# EAGLE design KeezerStat (EAGLE 5.09)
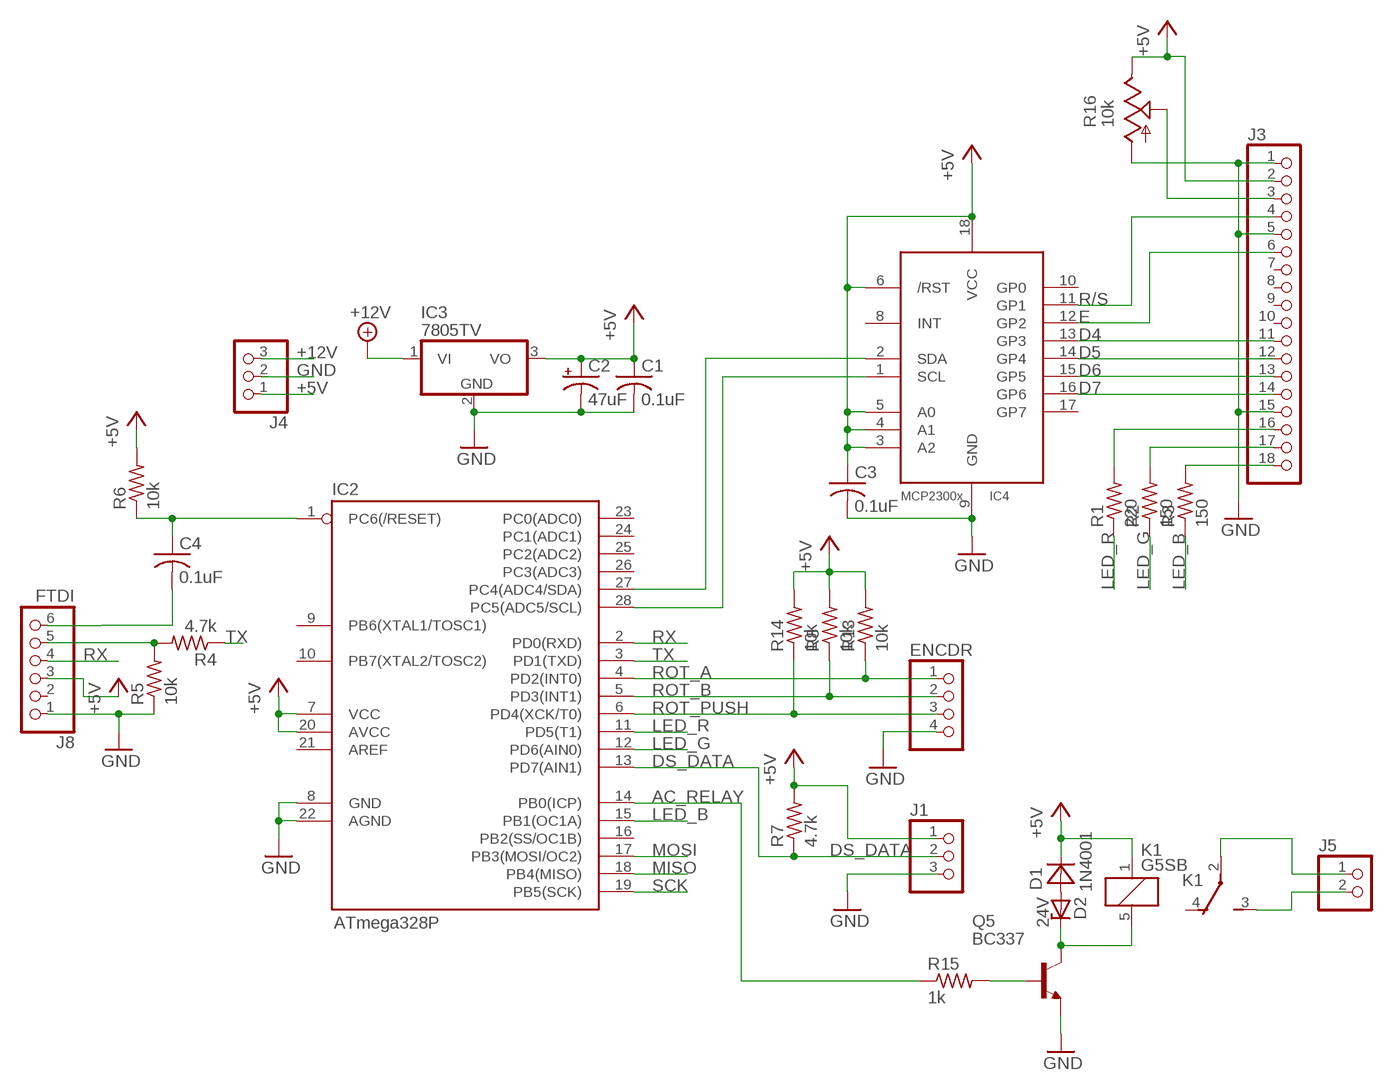
[diagram p0: schematic, sheet 1]

## Parts
C1  0.1uF  C-US025-025X050  [C025-025X050]
C2  47uF  CPOL-USE2.5-6  [E2,5-6]
C3  0.1uF  C-US025-025X050  [C025-025X050]
C4  0.1uF  C-US025-025X050  [C025-025X050]
D1  1N4001  DIODE-DO41-7  [DO41-7]
D2  24V  ZENER-DIODEZD-7.5  [ZDIO-7.5]
ENCDR  PINHD-1X4  [1X04]
IC2  ATmega328P  AVR-MEGA8-PPTH  [DIL28-3]
IC3  7805TV  [TO220V]
IC4  MCP2300X/P  [DIL18]
J1  PINHD-1X3  [1X03]
J3  PINHD-1X18  [1X18]
J4  PINHD-1X3  [1X03]
J5  PINHD-1X2  [1X02]
J8  FTDI  PINHD-1X6  [1X06]
K1  G5SB  [G5SB]
Q5  BC337  [TO92]
R1  220  R-US_0204/7  [0204/7]
R2  150  R-US_0204/7  [0204/7]
R3  150  R-US_0204/7  [0204/7]
R4  4.7k  R-US_0204/7  [0204/7]
R5  10k  R-US_0204/7  [0204/7]
R6  10k  R-US_0204/7  [0204/7]
R7  4.7k  R-US_0204/7  [0204/7]
R8  10k  R-US_0204/7  [0204/7]
R13  10k  R-US_0204/7  [0204/7]
R14  10k  R-US_0204/7  [0204/7]
R15  1k  R-US_0204/7  [0204/7]
R16  10k  TRIM_US-CT6  [CT6]

## Nets
+5V: C1.1 C2.+ C3.1 D1.C IC2.7(VCC) IC2.20(AVCC) IC3.3(VO) IC4.3(A2) IC4.4(A1) IC4.5(A0) IC4.6(/RST) IC4.18(VCC) J1.1 J3.2 J4.1 J8.3 K1.1 R6.2 R7.2 R8.2 R13.2 R14.2 R16.E
+12V: IC3.1(VI) J4.3
AC_RELAY: IC2.14(PB0(ICP)) R15.1
D4: IC4.13(GP3) J3.11
D5: IC4.14(GP4) J3.12
D6: IC4.15(GP5) J3.13
D7: IC4.16(GP6) J3.14
DS_DATA: IC2.13(PD7(AIN1)) J1.2 R7.1
E: IC4.12(GP2) J3.6
GND: C1.2 C2.- C3.2 ENCDR.4 IC2.8(GND) IC2.22(AGND) IC3.2(GND) IC4.9(GND) J1.3 J3.1 J3.5 J3.15 J4.2 J8.1 Q5.1(E) R5.1 R16.A
HOTIN: J5.1 K1.2(U:P)
HOTOUT: J5.2 K1.3(U:S)
LED_B: IC2.15(PB1(OC1A)) R3.1
LED_G: IC2.12(PD6(AIN0)) R2.1
LED_R: IC2.11(PD5(T1)) R1.1
MISO: IC2.18(PB4(MISO))
MOSI: IC2.17(PB3(MOSI/OC2))
N$1: J3.18 R3.2
N$2: J3.17 R2.2
N$3: J3.16 R1.2
N$4: J8.5 R4.2 R5.2
N$5: D1.A D2.A
N$6: J3.3 R16.S
N$7: IC2.27(PC4(ADC4/SDA)) IC4.2(SDA)
N$8: IC2.28(PC5(ADC5/SCL)) IC4.1(SCL)
N$9: C4.2 J8.6
N$10: C4.1 IC2.1(PC6(/RESET)) R6.1
N$17: Q5.2(B) R15.2
N$19: D2.C K1.5 Q5.3(C)
R/S: IC4.11(GP1) J3.4
ROT_A: ENCDR.1 IC2.4(PD2(INT0)) R13.1
ROT_B: ENCDR.2 IC2.5(PD3(INT1)) R8.1
ROT_PUSH: ENCDR.3 IC2.6(PD4(XCK/T0)) R14.1
RX: IC2.2(PD0(RXD)) J8.4
SCK: IC2.19(PB5(SCK))
TX: IC2.3(PD1(TXD)) R4.1
Unconnected: IC2.9(PB6(XTAL1/TOSC1)) IC2.10(PB7(XTAL2/TOSC2)) IC2.16(PB2(SS/OC1B)) IC2.21(AREF) IC2.23(PC0(ADC0)) IC2.24(PC1(ADC1)) IC2.25(PC2(ADC2)) IC2.26(PC3(ADC3)) IC4.8(INT) IC4.10(GP0) IC4.17(GP7) J3.7 J3.8 J3.9 J3.10 J8.2 K1.4(U:O)

## Library data of the parts
C1 C3 C4 = resistor:C-US: CAPACITOR, American symbol
C2 = resistor:CPOL-US: POLARIZED CAPACITOR, American symbol
D1 = Bryan:DIODE-: DO41 diodes with octagon holes and no diode symbol in silk
D2 = diode:ZENER-DIODE: Z-Diode
ENCDR = pinhead:PINHD-1X4: PIN HEADER
IC2 = SparkFun:AVR-MEGA8-P: MICROCONTROLLER 8 Kbytes FLASH 1 kbytes SRAM 512 bytes EEPROM USART 4-channel 10 bit ADC 2-channel 8 bit ADC
IC3 = linear:78*: Positive VOLTAGE REGULATOR Source: http://cache.national.com/ds/LM/LM78L05.pdf http://www.fairchildsemi.com/ds/LM/LM7805.pdf
IC4 = adafruit:MCP2300X: MCP23008 Inexpensive i2c i/o expander - 8 general purpose i/o pins with optional pullups
J1 J4 = pinhead:PINHD-1X3: PIN HEADER
J3 = pinhead:PINHD-1X18: PIN HEADER
J5 = pinhead:PINHD-1X2: PIN HEADER
J8 = pinhead:PINHD-1X6: PIN HEADER
K1 = relay:G5SB: Compact Single-pole Relay for Switching 5 A Source: http://www.omron.com/ecb/products/pry/121/g5sb.html
Q5 = transistor-npn:BC337*: NPN Transistor
R1-R8 R13-R15 = resistor:R-US_: RESISTOR, American symbol
R16 = pot:TRIM_US-: POTENTIOMETER

## Net classes
1 POW: width 0.381 mm
2 HIGHPOW: width 0.508 mm

## Board
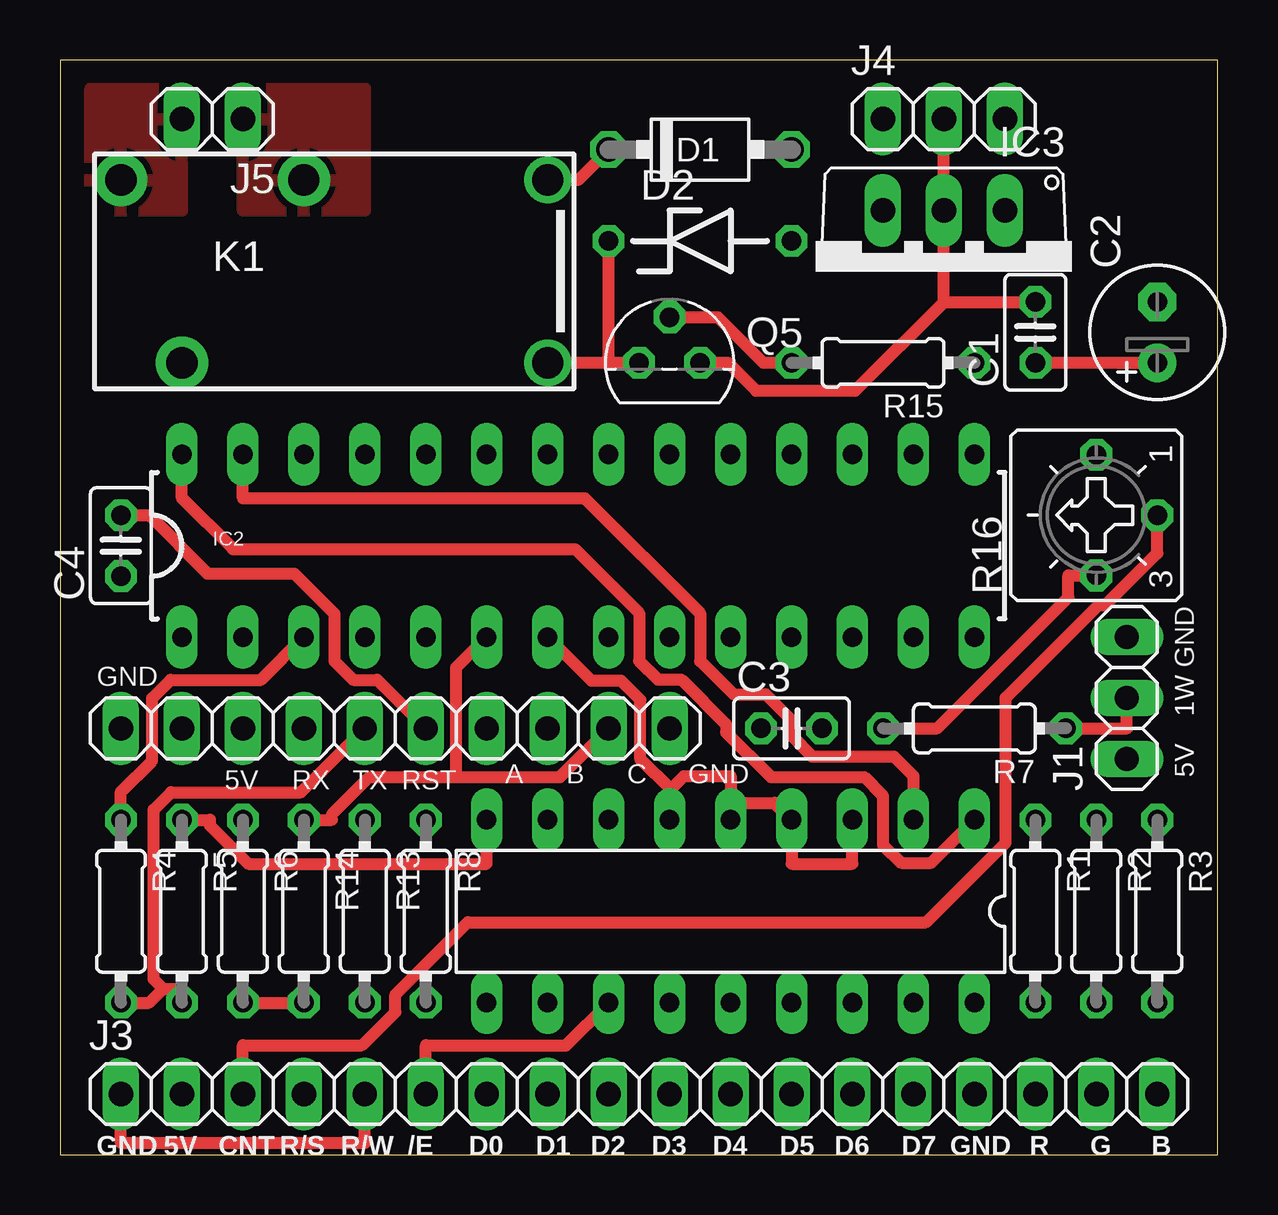
[diagram p1: board, top side]
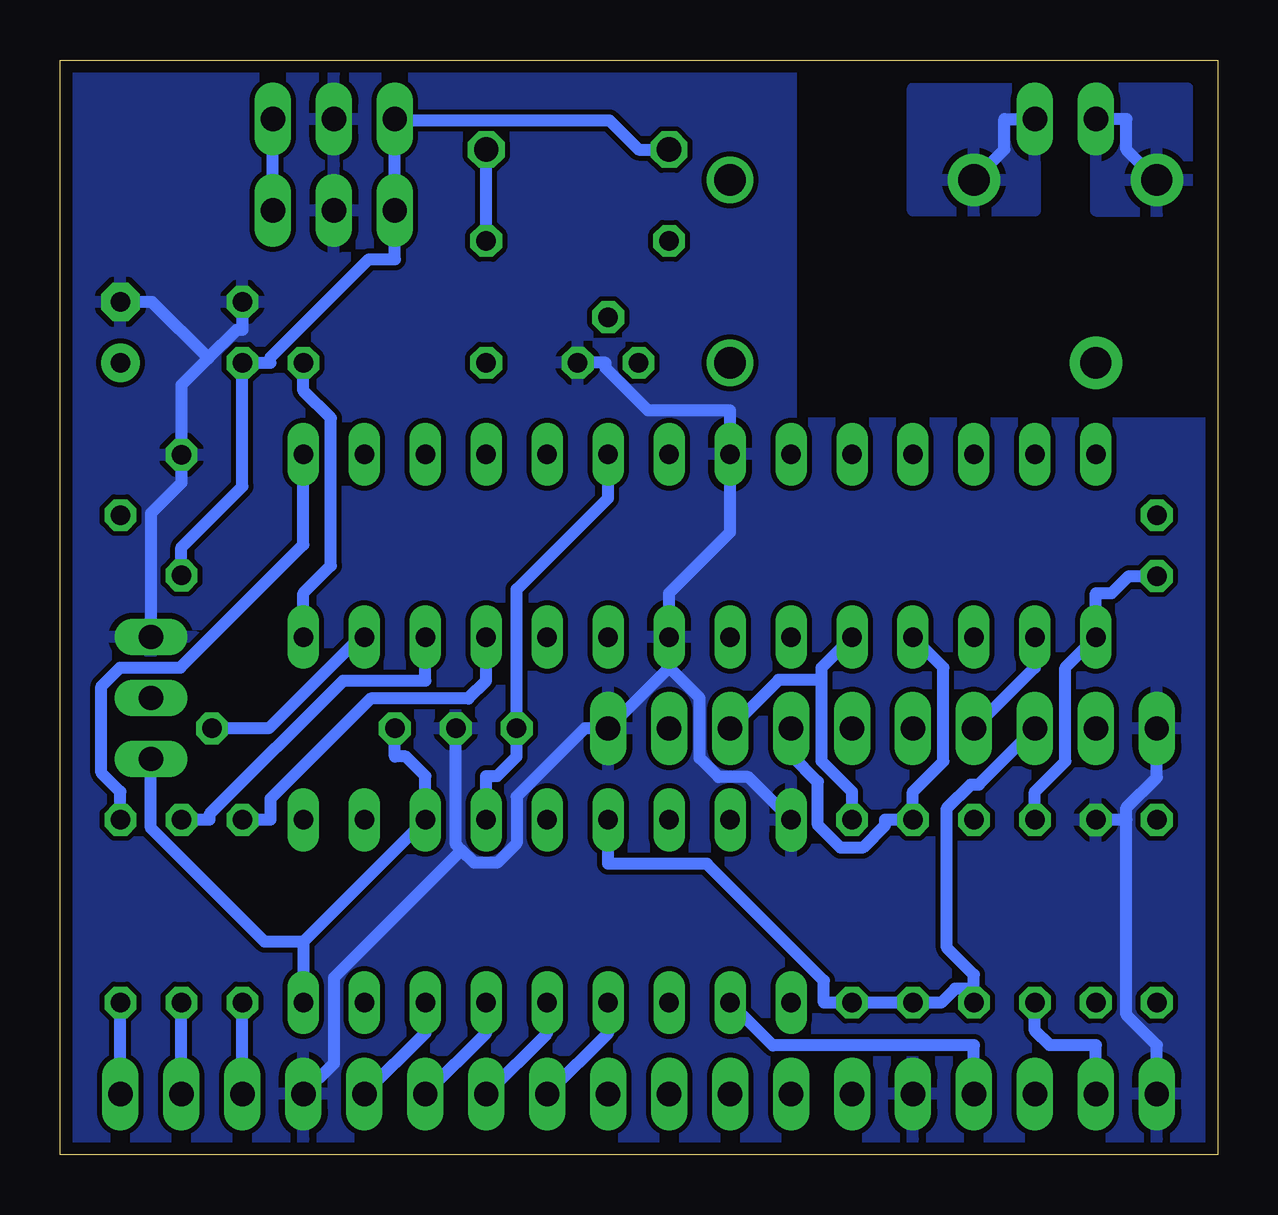
[diagram p2: board, bottom side, seen from below]

Size 48.24 x 45.64 mm. Coordinates in mm from the lower left corner, seen from the top.
Outline: 0,0 48.24,0 48.24,45.64 0,45.64 0,0
Copper layers (1*16): Top 0.035mm / dielectric 1.5mm / Bottom 0.035mm
Design rules "default *": minimum track width 20mil, minimum drill 24mil, track to track 8mil, track to pad 8mil, pad to pad 8mil, via to via 8mil, smd to smd 8mil, copper to edge 20mil, drill to drill 8mil, minimum pad ring 10mil, minimum via ring 8mil, stop-mask expansion 4mil, vias tented up to drill 0mil, thermal gap 10mil

### Footprints (pad centres in the part's own frame; a part is rotated, then mirrored left to right if it is on the bottom)
C025-025X050 = drill 0.813 octagon: 1 -1.27,0; 2 1.27,0
E2,5-6 = drill 0.813 pad 1.6 round: + -1.27,0 | drill 0.813 pad 1.6 octagon: - 1.27,0
DO41-7 = drill 1.016 octagon: A 3.81,0; C -3.81,0
ZDIO-7.5 = drill 0.813 octagon: A 3.81,0; C -3.81,0
1X04 = drill 1.016 long: 1 -3.81,0; 2 -1.27,0; 3 1.27,0; 4 3.81,0
DIL28-3 = drill 0.813 long: 1 -16.51,-3.81; 2 -13.97,-3.81; 3 -11.43,-3.81; 4 -8.89,-3.81; 5 -6.35,-3.81; 6 -3.81,-3.81; 7 -1.27,-3.81; 8 1.27,-3.81; 9 3.81,-3.81; 10 6.35,-3.81; 11 8.89,-3.81; 12 11.43,-3.81; 13 13.97,-3.81; 14 16.51,-3.81; 15 16.51,3.81; 16 13.97,3.81; 17 11.43,3.81; 18 8.89,3.81; 19 6.35,3.81; 20 3.81,3.81; 21 1.27,3.81; 22 -1.27,3.81; 23 -3.81,3.81; 24 -6.35,3.81; 25 -8.89,3.81; 26 -11.43,3.81; 27 -13.97,3.81; 28 -16.51,3.81
TO220V = drill 1.016 long: 1 -2.54,-2.54; 2 0,-2.54; 3 2.54,-2.54
DIL18 = drill 0.813 long: 1 -10.16,-3.81; 2 -7.62,-3.81; 3 -5.08,-3.81; 4 -2.54,-3.81; 5 0,-3.81; 6 2.54,-3.81; 7 5.08,-3.81; 8 7.62,-3.81; 9 10.16,-3.81; 10 10.16,3.81; 11 7.62,3.81; 12 5.08,3.81; 13 2.54,3.81; 14 0,3.81; 15 -2.54,3.81; 16 -5.08,3.81; 17 -7.62,3.81; 18 -10.16,3.81
1X03 = drill 1.016 long: 1 -2.54,0; 2 0,0; 3 2.54,0
1X18 = drill 1.016 long: 1 -21.59,0; 2 -19.05,0; 3 -16.51,0; 4 -13.97,0; 5 -11.43,0; 6 -8.89,0; 7 -6.35,0; 8 -3.81,0; 9 -1.27,0; 10 1.27,0; 11 3.81,0; 12 6.35,0; 13 8.89,0; 14 11.43,0; 15 13.97,0; 16 16.51,0; 17 19.05,0; 18 21.59,0
1X02 = drill 1.016 long: 1 -1.27,0; 2 1.27,0
1X06 = drill 1.016 long: 1 -6.35,0; 2 -3.81,0; 3 -1.27,0; 4 1.27,0; 5 3.81,0; 6 6.35,0
G5SB = drill 1.3 pad 1.93 round: 1 7.62,3.81; 5 7.62,-3.81 | drill 1.3 pad 2.184 round: 2 -2.54,3.81; 3 -10.16,3.81; 4 -7.62,-3.81
TO92 = drill 0.813 octagon: 1 1.27,0; 2 0,1.905; 3 -1.27,0
0204/7 = drill 0.813 octagon: 1 -3.81,0; 2 3.81,0
CT6 = drill 0.813 octagon: A 2.515,0; E -2.515,0; S 0,-2.54

### Placement (x,y rotation side)
C1  40.64,34.29 90 top
C2  45.72,34.29 90 top
C3  30.48,17.78 0 top
C4  2.54,25.4 90 top
D1  26.67,41.91 0 top
D2  26.67,38.1 0 top
ENCDR  21.59,17.78 0 top
IC2  21.59,25.4 0 top
IC3  36.83,36.83 180 top
IC4  27.94,10.16 180 top
J1  44.45,19.05 90 top
J3  24.13,2.54 0 top
J4  36.83,43.18 0 top
J5  6.35,43.18 180 top
J8  8.89,17.78 0 top
K1  12.7,36.83 0 top
Q5  25.4,33.02 0 top
R1  40.64,10.16 270 top
R2  43.18,10.16 270 top
R3  45.72,10.16 270 top
R4  2.54,10.16 270 top
R5  5.08,10.16 270 top
R6  7.62,10.16 270 top
R7  38.1,17.78 180 top
R8  15.24,10.16 270 top
R13  12.7,10.16 270 top
R14  10.16,10.16 270 top
R15  34.29,33.02 180 top
R16  43.18,26.67 90 top

### Tracks (layer width: path | path; a pad name or v marks a point on that pad's centre or on a via)
+5V
  Top 0.508: 27.94,14.68 29.77,14.68 IC4.4 30.48,12.14 33.02,12.14 IC4.3 | 27.94,14.68 27.94,15.8 26.01,15.8 25.44,15.23 | 27.94,14.68 IC4.5 | IC4.6 25.4,15.19 25.44,15.23 | 25.44,15.23 24.18,16.48 24.18,18.96 23.38,19.76 22.15,19.76 IC2.7 | R16.E 42.01,24.16 42.01,23.24 36.55,17.78 R7.2 | C1.1 C2.+ | K1.1 21.59,40.64 D1.C | R6.2 R14.2
  Bottom 0.508: J3.2 5.08,4.57 7.01,4.57 7.62,5.18 R6.2 | R16.E 43.18,25.32 40.64,27.86 C1.1 39.47,33.02 39.47,33.24 35.37,37.34 34.29,37.34 IC3.3 34.29,43.13 | D1.C 24.13,41.91 25.35,43.13 34.29,43.13 | 34.29,43.13 J4.1 | R7.2 34.29,16.61 33.83,16.61 33.02,15.8 IC4.3 38.1,8.89 | 10.16,6.93 10.95,6.93 11.53,6.35 R13.2 R8.2 16.41,6.35 16.41,7.26 21.29,12.14 25.4,12.14 IC4.6 | 10.16,6.93 10.16,7.52 11.28,8.64 11.28,14.46 10.3,15.44 9.96,15.44 J8.3 | R14.2 10.16,6.93 | 38.1,8.89 39.72,8.89 44.45,13.62 J1.1 | 38.1,8.89 38.1,7.26 IC4.18 | IC2.20 25.4,27.38 29.21,23.57 C3.1 29.21,16.61 30.02,15.8 30.48,15.8 IC4.4
+12V
  Bottom 0.508: IC3.1 J4.3
AC_RELAY
  Bottom 0.508: IC2.14 38.1,23.42 36.96,24.56 36.96,30.71 38.1,31.85 R15.1
D4
  Bottom 0.508: J3.11 25.4,5.08 IC4.13
D5
  Bottom 0.508: J3.12 27.94,5.08 IC4.14
D6
  Bottom 0.508: J3.13 30.48,5.08 IC4.15
D7
  Bottom 0.508: J3.14 33.02,5.08 IC4.16
DS_DATA
  Top 0.508: J1.2 44.45,17.78 R7.1
  Bottom 0.508: R7.1 39.55,17.78 35.74,21.59 IC2.13
E
  Top 0.508: J3.6 15.24,4.57 21.08,4.57 IC4.12
GND
  Top 0.508: J3.1 2.54,0.51 12.7,0.51 J3.5 | R5.1 6.25,13.97 6.25,13.73 7.83,12.14 17.78,12.14 IC4.9 | J4.2 IC3.2 36.83,35.56 | 36.83,35.56 33.12,31.85 29,31.85 27.84,33.02 Q5.1 | 36.83,35.56 C1.2
  Bottom 0.508: 3.81,13.97 3.81,5.84 2.54,4.57 J3.1 | 3.81,13.97 3.81,14.48 2.54,15.75 J8.1 | 3.81,13.97 3.91,13.97 R5.1 | J1.3 44.45,26.75 43.18,28.02 R16.A 43.18,32.09 42.06,33.21 | 42.06,33.21 40.88,34.39 40.64,34.39 C1.2 | 42.06,33.21 44.41,35.56 C2.- | Q5.1 25.5,33.02 25.5,32.8 23.74,31.04 20.32,31.04 IC2.22 20.32,25.96 22.86,23.42 IC2.8 22.86,20.32 | 31.51,12.7 31.75,12.94 C3.2 | 31.51,12.7 30.99,12.18 30.02,12.18 29.21,12.99 29.21,14.94 26.37,17.78 ENCDR.4 22.86,20.32 | J3.15 36.83,3.81 36.83,7.39 31.51,12.7 | IC4.9 19.56,15.75 20.8,15.75 21.59,16.54 21.59,19.05 22.86,20.32
  pour Bottom: 0,0 0,30.48 17.78,30.48 17.78,45.72 48.26,45.72 48.26,0
HOTIN
  Bottom 0.508: J5.1 8.89,43.18 8.89,41.91 K1.2
  pour Bottom: 7.62,44.45 7.62,39.37 12.7,39.37 12.7,44.45
  pour Top: 12.7,44.45 12.7,39.37 7.62,39.37 7.62,44.45
HOTOUT
  Bottom 0.508: J5.2 3.81,43.18 3.81,41.91 K1.3
  pour Bottom: 1.27,39.37 1.27,44.45 5.08,44.45 5.08,39.37
  pour Top: 1.27,44.45 5.08,44.45 5.08,39.37 1.27,39.37
LED_B
  Bottom 0.508: R3.1 45.72,15.14 46.52,15.94 46.52,19.53 45.73,20.32 43.22,20.32 38.1,25.44 IC2.15
LED_G
  Bottom 0.508: IC2.12 33.02,19.76 36.44,19.76 42.01,14.19 42.01,13.97 R2.1
LED_R
  Bottom 0.508: IC2.11 30.48,19.76 31.22,19.02 35.3,19.02 39.47,14.85 39.47,13.97 R1.1
N$1
  Bottom 0.508: J3.18 R3.2
N$2
  Bottom 0.508: J3.17 R2.2
N$3
  Bottom 0.508: J3.16 R1.2
N$4
  Top 0.508: 4.29,6.93 3.71,6.35 R4.2 | 4.29,6.93 5.08,6.93 R5.2 | 4.29,6.93 3.9,7.33 3.9,14.38 4.63,15.12 10.04,15.12 J8.5
N$5
  Bottom 0.508: D2.A D1.A
N$6
  Top 0.508: J3.3 7.62,4.57 12.59,4.57 13.97,5.96 13.97,6.68 16.99,9.7 36.09,9.7 39.41,13.01 39.41,19.05 43.27,22.92 43.55,22.92 45.72,25.09 R16.S
N$7
  Top 0.508: IC2.27 7.62,27.38 21.87,27.38 26.67,22.59 26.67,20.59 28.07,19.2 29.4,19.2 30.48,18.12 30.48,17.46 31.33,16.61 34.75,16.61 35.56,15.8 IC4.2
N$8
  Top 0.508: IC4.1 36.31,12.18 35.05,12.18 34.29,12.93 34.29,14.96 33.5,15.75 29.63,15.75 27.76,17.62 27.76,17.93 25.88,19.81 24.92,19.81 24.13,20.6 24.13,22.59 21.47,25.25 7.21,25.25 5.08,27.38 IC2.28
N$9
  Top 0.508: C4.2 3.71,26.67 6.14,24.23 9.76,24.23 11.43,22.57 11.43,20.59 12.21,19.81 13.21,19.81 J8.6
N$10
  Bottom 0.508: C4.1 3.71,24.13 4.42,23.42 5.08,23.42 IC2.1 6.35,20.32 6.35,16.41 7.62,15.14 R6.1
N$17
  Top 0.508: R15.2 29.31,33.02 27.41,34.92 Q5.2
N$19
  Top 0.508: K1.5 22.86,33.02 | 22.86,33.02 Q5.3 | 22.86,33.02 22.86,36.93 D2.C
R/S
  Bottom 0.508: J3.4 10.16,4.57 18.54,4.57 IC4.11
ROT_A
  Bottom 0.508: ENCDR.1 17.78,16.67 16.66,15.55 16.66,13.76 15.71,12.81 14.8,12.81 13.87,13.74 13.87,13.97 R13.1 12.7,15.14 11.43,16.41 11.43,20.32 IC2.4
ROT_B
  Bottom 0.508: 16.51,19.81 16.51,20.32 IC2.5 | 16.51,19.81 16.51,16.41 15.24,15.14 R8.1 | ENCDR.2 18.29,19.81 16.51,19.81
ROT_PUSH
  Top 0.508: 16.51,15.75 16.51,20.32 IC2.6 | 16.51,15.75 20.83,15.75 ENCDR.3 | 16.51,15.75 12.89,15.75 11.33,14.19 11.33,13.97 R14.1
RX
  Bottom 0.508: J8.4 7.62,20.32 IC2.2
TX
  Top 0.508: R4.1 2.54,15.14 3.83,16.43 3.83,19.03 4.61,19.81 8.38,19.81 IC2.3

### Text on the board
_tsilk: GND | GND | 1W | 5V | 5V | RX | TX | RST | A | B | C | GND | GND | 5V | CNT | R/S | R/W | /E | D0 | D1 | D2 | D3 | D4 | D5 | D6 | D7 | GND | R | G | B
200bmp: C:/Users/bmayland/Documents/Beers.bmp